# EasyEDA schematic control board.json
TITLE: Sheet_1; REV: 1.0; Date: 2021-07-24; Sheet: 1/1; Drawn By: Gustavo Moraes; Company: Your Company
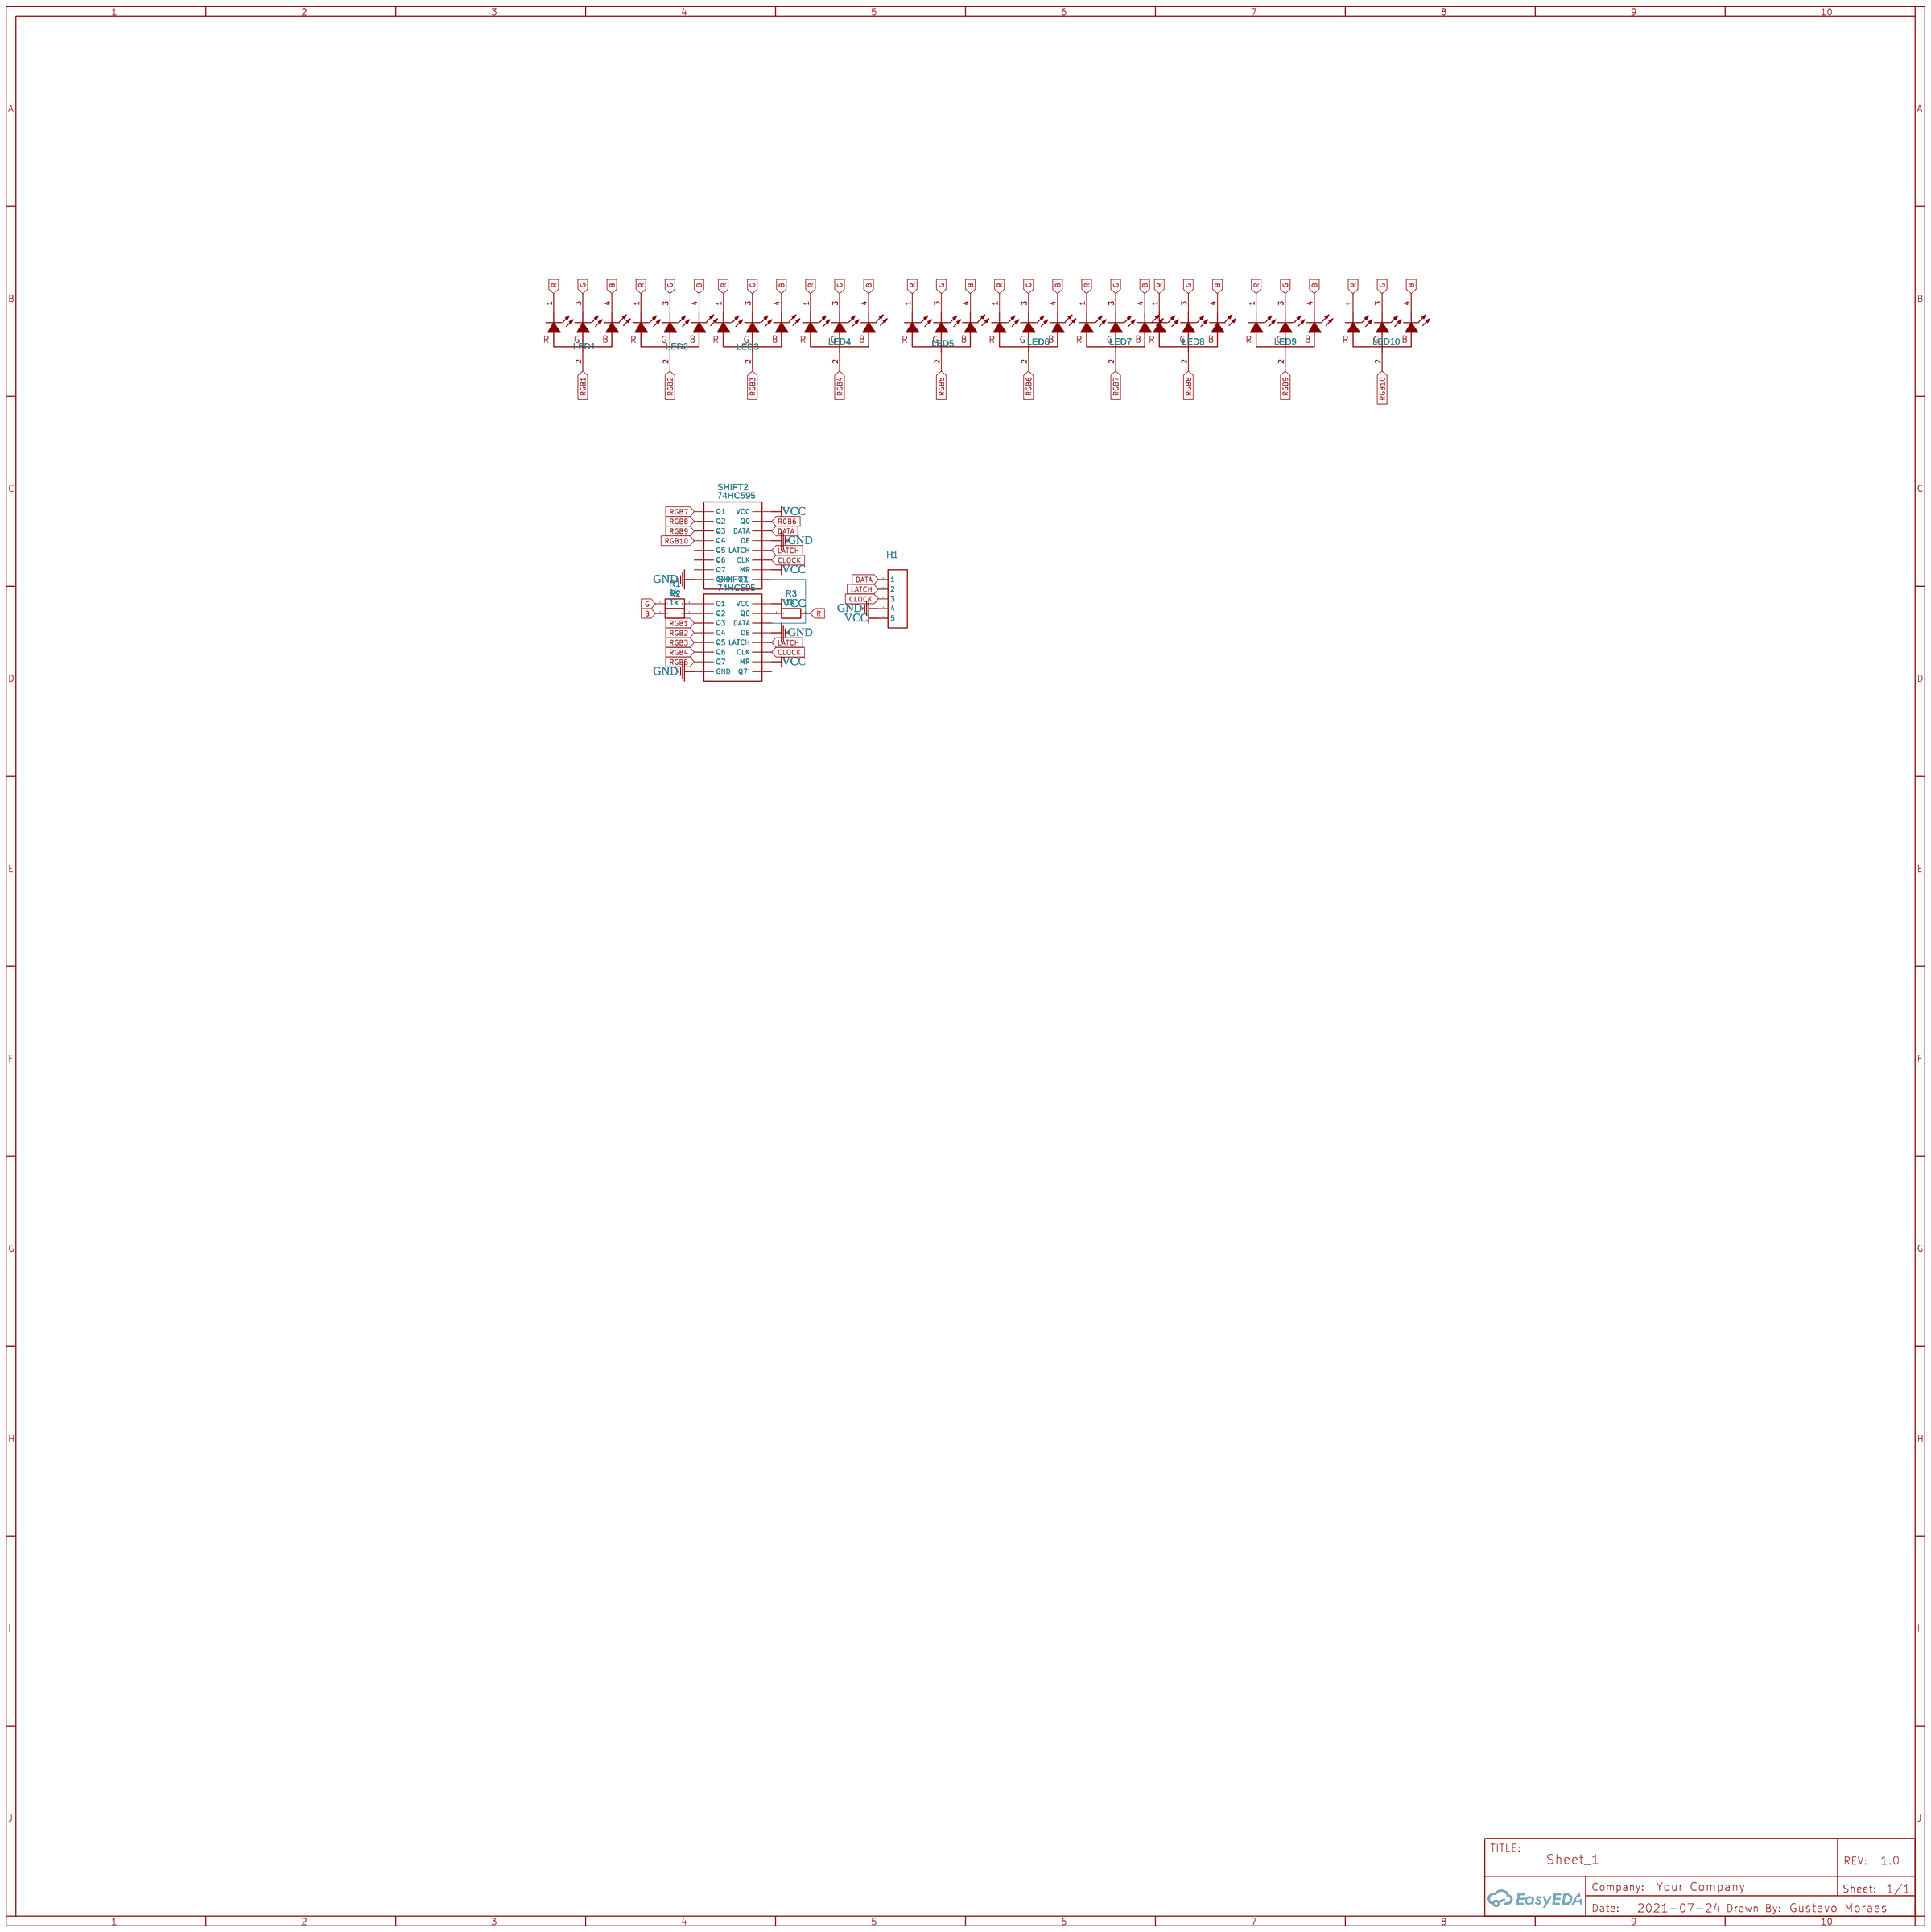
[diagram p0: schematic sheet]

## Parts
H1  HDR-F-2.54_1x5  [HDR-F-2.54_1X5]
LED1  φ5 RGB Transparent  [LED-TH_4P-BD5.8-P1.30]
LED2  φ5 RGB Transparent  [LED-TH_4P-BD5.8-P1.30]
LED3  φ5 RGB Transparent  [LED-TH_4P-BD5.8-P1.30]
LED4  φ5 RGB Transparent  [LED-TH_4P-BD5.8-P1.30]
LED5  φ5 RGB Transparent  [LED-TH_4P-BD5.8-P1.30]
LED6  φ5 RGB Transparent  [LED-TH_4P-BD5.8-P1.30]
LED7  φ5 RGB Transparent  [LED-TH_4P-BD5.8-P1.30]
LED8  φ5 RGB Transparent  [LED-TH_4P-BD5.8-P1.30]
LED9  φ5 RGB Transparent  [LED-TH_4P-BD5.8-P1.30]
LED10  φ5 RGB Transparent  [LED-TH_4P-BD5.8-P1.30]
R1  1k  [R_AXIAL-0.3]
R2  1k  [R_AXIAL-0.3]
R3  1k  [R_AXIAL-0.3]
SHIFT1  74HC595  [DIP-16]
SHIFT2  74HC595  [DIP-16]

## Library data of the parts
H1 = HDR-F-2.54_1x5: Supplier Part: C50950; Supplier: LCSC; Contributor: LCEDA_Lib
LED1 LED2 LED4-LED10 = φ5 RGB Transparent: Supplier: LCSC; Manufacturer: KENTO; Manufacturer Part: φ5 RGB Transparent LED; Contributor: LCSC; Supplier Part: C32985; Package Display: No
LED3 = φ5 RGB Transparent: Supplier: LCSC; Manufacturer: KENTO; Manufacturer Part: φ5 RGB Transparent LED; Contributor: LCSC; Supplier Part: C32985
R1-R3 = R_AXIAL-0.3_EU: Contributor: LCEDA_Lib
SHIFT1 SHIFT2 = 74HC595: Contributor: prizmi.linek

## Nets
GND: H1.4 SHIFT1.8(GND) SHIFT1.13(OE) SHIFT2.8(GND) SHIFT2.13(OE)
VCC: H1.5 SHIFT1.10(MR) SHIFT1.16(VCC) SHIFT2.10(MR) SHIFT2.16(VCC)
B: LED1.4(KB) LED2.4(KB) LED3.4(KB) LED4.4(KB) LED5.4(KB) LED6.4(KB) LED7.4(KB) LED8.4(KB) LED9.4(KB) LED10.4(KB) R2.1
CLOCK: H1.3 SHIFT1.11(CLK) SHIFT2.11(CLK)
DATA: H1.1 SHIFT2.14(DATA)
G: LED1.3(KG) LED2.3(KG) LED3.3(KG) LED4.3(KG) LED5.3(KG) LED6.3(KG) LED7.3(KG) LED8.3(KG) LED9.3(KG) LED10.3(KG) R1.1
LATCH: H1.2 SHIFT1.12(LATCH) SHIFT2.12(LATCH)
R: LED1.1(KR) LED2.1(KR) LED3.1(KR) LED4.1(KR) LED5.1(KR) LED6.1(KR) LED7.1(KR) LED8.1(KR) LED9.1(KR) LED10.1(KR) R3.2
RGB1: LED1.2(CA) SHIFT1.3(Q3)
RGB2: LED2.2(CA) SHIFT1.4(Q4)
RGB3: LED3.2(CA) SHIFT1.5(Q5)
RGB4: LED4.2(CA) SHIFT1.6(Q6)
RGB5: LED5.2(CA) SHIFT1.7(Q7)
RGB6: LED6.2(CA) SHIFT2.15(Q0)
RGB7: LED7.2(CA) SHIFT2.1(Q1)
RGB8: LED8.2(CA) SHIFT2.2(Q2)
RGB9: LED9.2(CA) SHIFT2.3(Q3)
RGB10: LED10.2(CA) SHIFT2.4(Q4)
Net-(R1-2): R1.2 SHIFT1.1(Q1)
Net-(R2-2): R2.2 SHIFT1.2(Q2)
Net-(R3-1): R3.1 SHIFT1.15(Q0)
Net-(SHIFT1-14): SHIFT1.14(DATA) SHIFT2.9(Q7')

Not connected (* = marked no-connect by the designer): SHIFT1 9(Q7'); SHIFT2 5(Q5) 6(Q6) 7(Q7)

## Notes on the sheet
- LED1
- LED10
